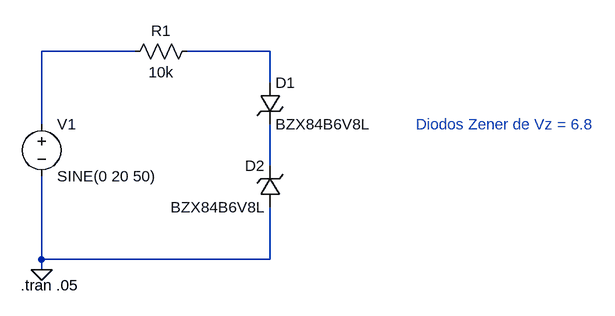
[diagram p0: schematic Diodo - Limitador_Diodo_Zener.asc]
Diodo - Limitador_Diodo_Zener.asc, the LTspice schematic file:
Version 4
SHEET 1 880 680
WIRE 144 80 0 80
WIRE 352 80 224 80
WIRE 352 128 352 80
WIRE 0 192 0 80
WIRE 352 256 352 192
WIRE 0 400 0 272
WIRE 352 400 352 320
WIRE 352 400 0 400
WIRE 0 416 0 400
FLAG 0 416 0
SYMBOL voltage 0 176 R0
SYMATTR InstName V1
SYMATTR Value SINE(0 20 50)
SYMBOL res 128 96 R270
WINDOW 0 32 56 VTop 2
WINDOW 3 0 56 VBottom 2
SYMATTR InstName R1
SYMATTR Value 10k
SYMBOL zener 336 128 R0
SYMATTR InstName D1
SYMATTR Value BZX84B6V8L
SYMBOL zener 368 320 R180
WINDOW 0 24 64 Left 2
WINDOW 3 24 0 Left 2
SYMATTR InstName D2
SYMATTR Value BZX84B6V8L
TEXT -32 440 Left 2 !.tran .05
TEXT 576 192 Left 2 ;Diodos Zener de Vz = 6.8

The netlist it stands for:
* Diodo - Limitador_Diodo_Zener.asc
V1 N001 0 SINE(0 20 50)
R1 N001 N002 10k
D1 N002 N003 BZX84B6V8L
D2 0 N003 BZX84B6V8L
.model D D
.lib standard.dio
.tran .05
* Diodos Zener de Vz = 6.8
.backanno
.end